# Altium project Isengard.PrjPcb
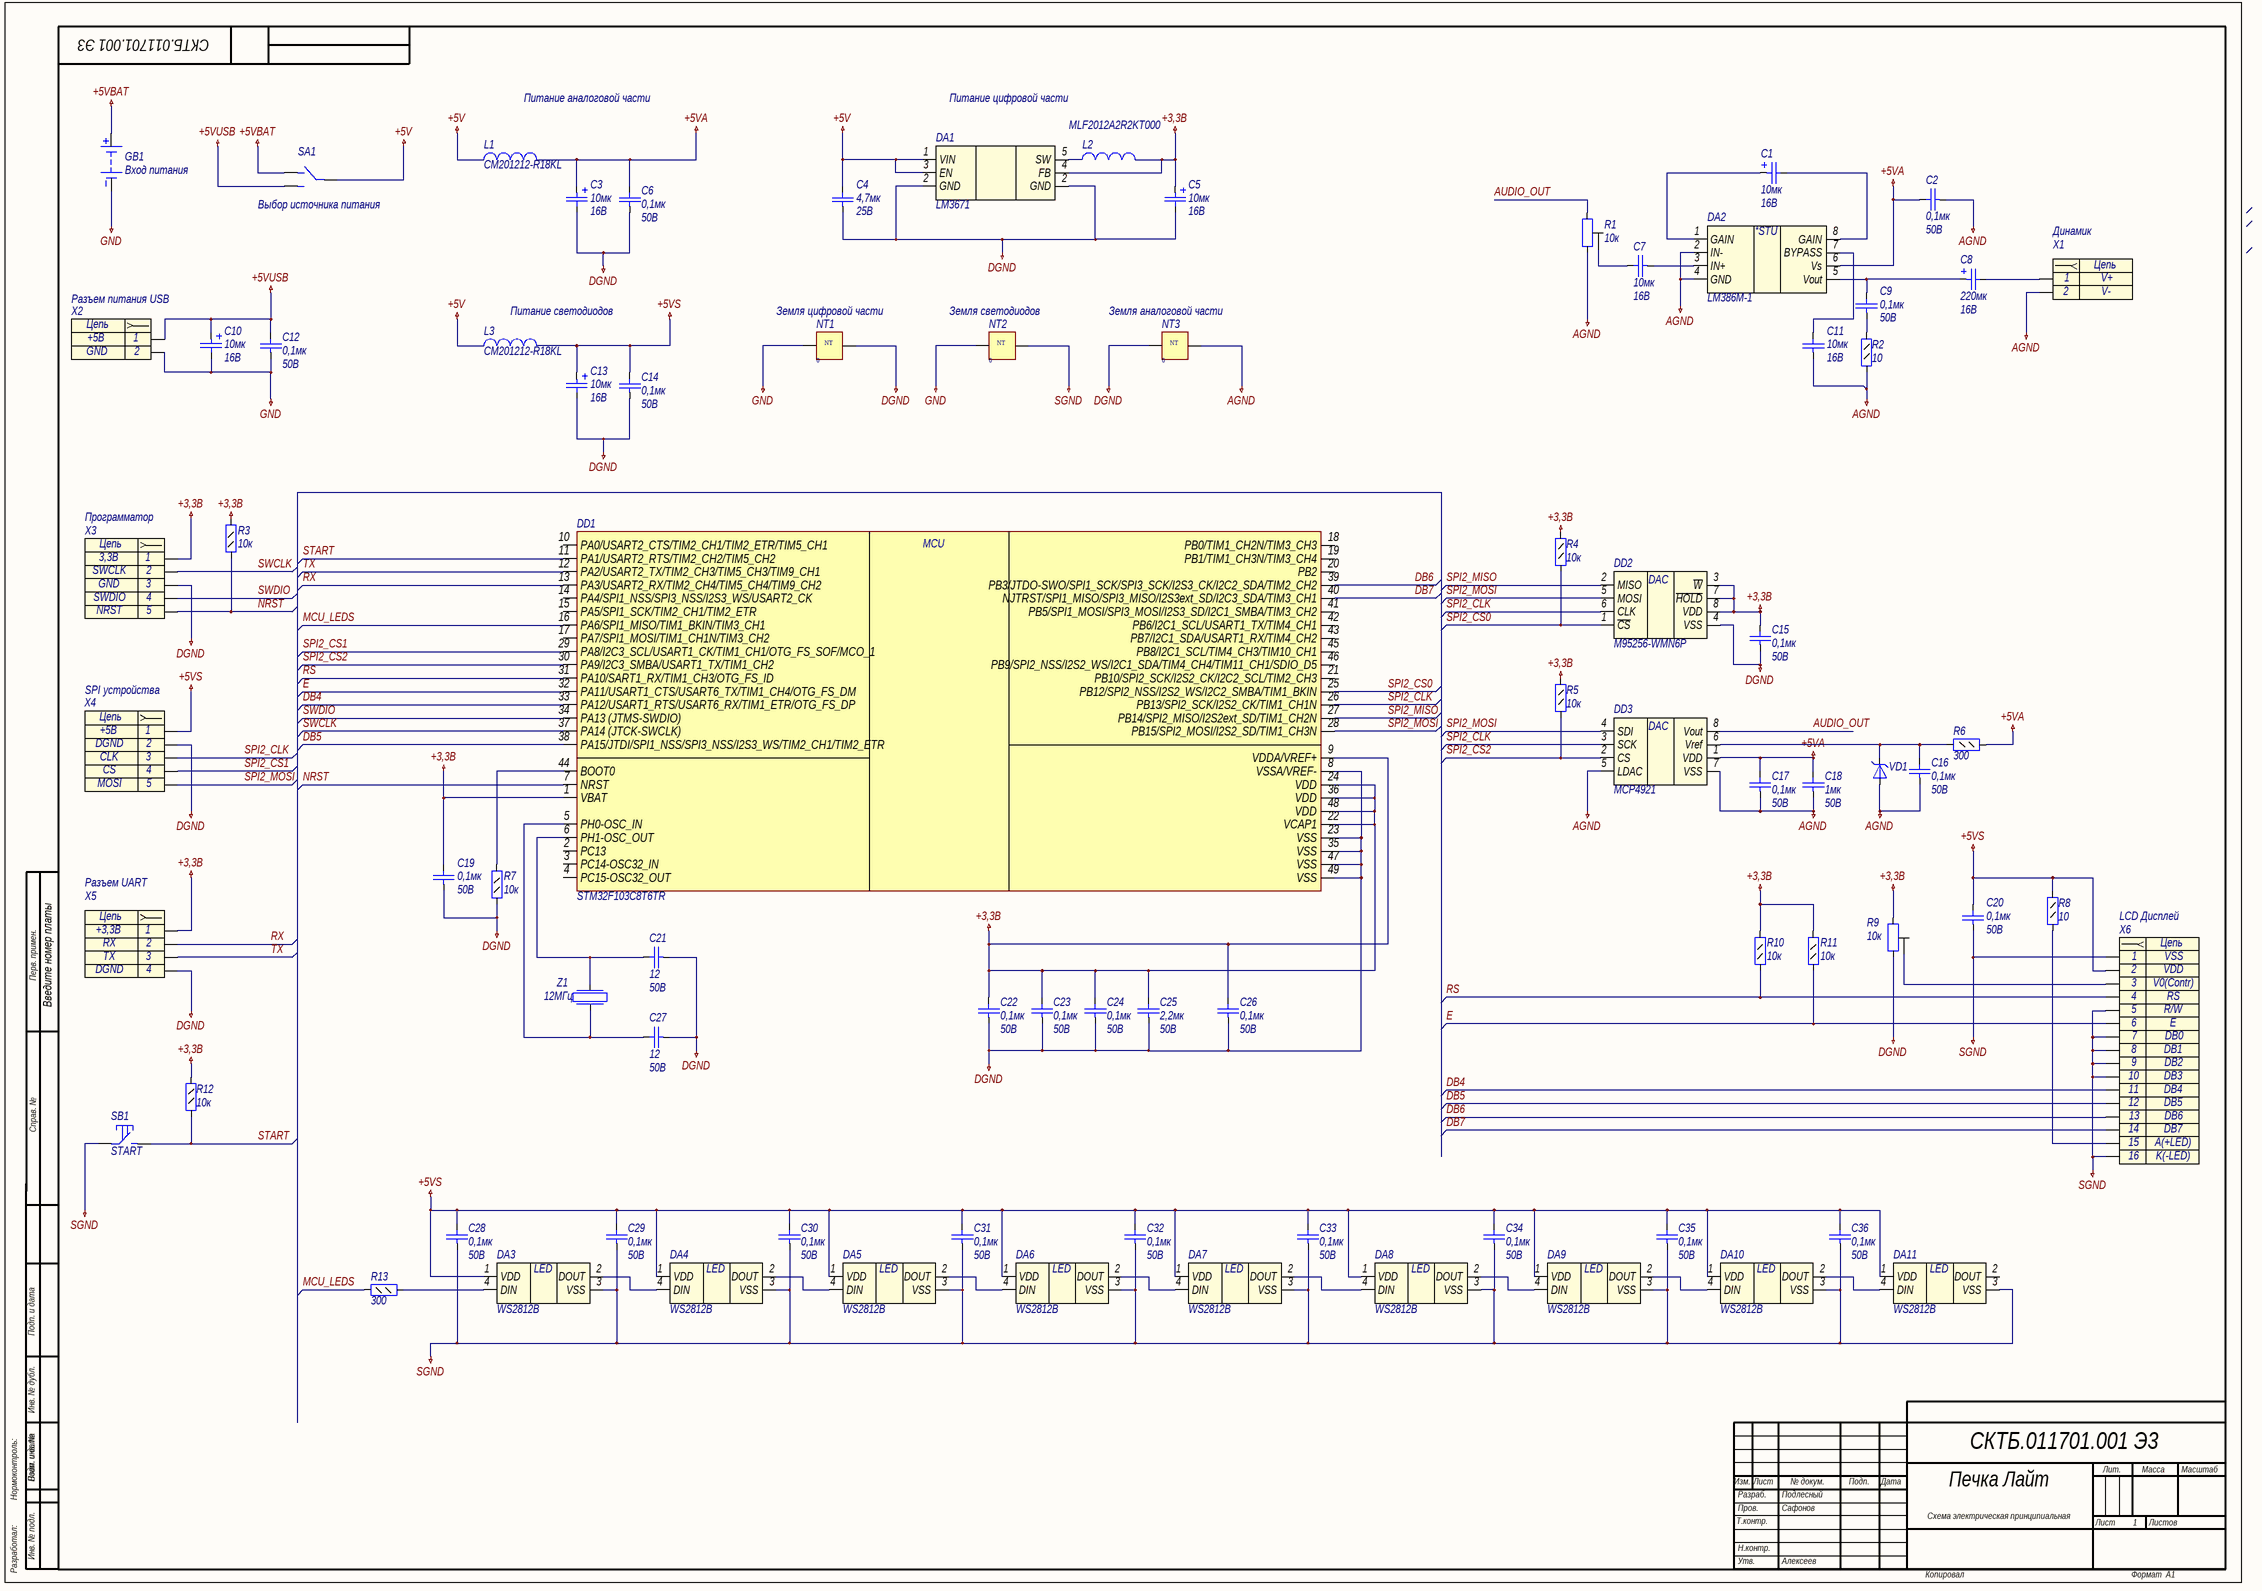
[diagram p0: Isengard.SchDoc]
1 sheet, 80 parts. Net scope: global (net labels, ports and power ports of the same name join across sheets).
Board file: Isengard.PcbDoc

## Sheet Isengard.SchDoc: Печка Лайт
size 840 x 594 mm; ApprovedBy: Алексеев; CheckedBy: Сафонов; Author: Подлесный; CompanyName: ЦНИИ РТК; DrawnBy: Подлесный; Engineer: Подлесный; Organization: ЦНИИ РТК; DocumentNumber: СКТБ.011701.001 Э3; Revision: Королев; SheetTotal: 1; DocumentType: Схема электрическая принципиальная; Format: A1; PageSetup: Record=PageOptions|CenterHorizontal=True|CenterVertical=True|PrintScale=0.35|XCorrection=1.00|YCorrection=1.00|PrintKind=1|BorderSize=5000000|LeftOffset=0|BottomOffset=0|Orientation=2|PaperLength=2970|PaperWidth=2100|Scale=100|PaperSource=7|PrintQuality=600|MediaType=1|DitherType=10|PrintScaleMode=1|PaperKind=A4|PaperIndex=9; DocumentName: Подарочный Кубок; ImagePath: Введите номер платы

### Parts
C1  Voltage: 16В  [TANTAL CASE B]  (hidden comment: 10мк)
C2  Voltage: 50В  [C0805]  (hidden comment: 0,1мк)
C3  Voltage: 16В  [TANTAL CASE B]  (hidden comment: 10мк)
C4  Voltage: 25В  [C0805]  (hidden comment: 4,7мк)
C5  Voltage: 16В  [TANTAL CASE B]  (hidden comment: 10мк)
C6  Voltage: 50В  [C0805]  (hidden comment: 0,1мк)
C7  Voltage: 16В  [C0805]  (hidden comment: 10мк)
C8  Voltage: 16В  [TANTAL CASE D]  (hidden comment: 220мк)
C9  Voltage: 50В  [C0805]  (hidden comment: 0,1мк)
C10  Voltage: 16В  [TANTAL CASE B]  (hidden comment: 10мк)
C11  Voltage: 16В  [C0805]  (hidden comment: 10мк)
C12  Voltage: 50В  [C0805]  (hidden comment: 0,1мк)
C13  Voltage: 16В  [TANTAL CASE B]  (hidden comment: 10мк)
C14  Voltage: 50В  [C0805]  (hidden comment: 0,1мк)
C15  Voltage: 50В  [C0805]  (hidden comment: 0,1мк)
C16  Voltage: 50В  [C0805]  (hidden comment: 0,1мк)
C17  Voltage: 50В  [C0805]  (hidden comment: 0,1мк)
C18  Voltage: 50В  [C0805]  (hidden comment: 1мк)
C19  Voltage: 50В  [C0805]  (hidden comment: 0,1мк)
C20  Voltage: 50В  [C0805]  (hidden comment: 0,1мк)
C21  Voltage: 50В  [C0805]  (hidden comment: 12)
C22  Voltage: 50В  [C0805]  (hidden comment: 0,1мк)
C23  Voltage: 50В  [C0805]  (hidden comment: 0,1мк)
C24  Voltage: 50В  [C0805]  (hidden comment: 0,1мк)
C25  Voltage: 50В  [C0805]  (hidden comment: 2,2мк)
C26  Voltage: 50В  [C0805]  (hidden comment: 0,1мк)
C27  Voltage: 50В  [C0805]  (hidden comment: 12)
C28  Voltage: 50В  [C0805]  (hidden comment: 0,1мк)
C29  Voltage: 50В  [C0805]  (hidden comment: 0,1мк)
C30  Voltage: 50В  [C0805]  (hidden comment: 0,1мк)
C31  Voltage: 50В  [C0805]  (hidden comment: 0,1мк)
C32  Voltage: 50В  [C0805]  (hidden comment: 0,1мк)
C33  Voltage: 50В  [C0805]  (hidden comment: 0,1мк)
C34  Voltage: 50В  [C0805]  (hidden comment: 0,1мк)
C35  Voltage: 50В  [C0805]  (hidden comment: 0,1мк)
C36  Voltage: 50В  [C0805]  (hidden comment: 0,1мк)
DA1  LM3671  [SOT23-5]
DA2  LM386M-1  [SO8]
DA3  WS2812B  [WS2812B]
DA4  WS2812B  [WS2812B]
DA5  WS2812B  [WS2812B]
DA6  WS2812B  [WS2812B]
DA7  WS2812B  [WS2812B]
DA8  WS2812B  [WS2812B]
DA9  WS2812B  [WS2812B]
DA10  WS2812B  [WS2812B]
DA11  WS2812B  [WS2812B]
DD1  STM32F103C8T6TR  [LQFP48]
DD2  M95256-WMN6P  [SO8]
DD3  MCP4921  [SO8]
GB1  Вход питания  [KLS5-818-С]
L1  CM201212-R18KL  [L0805]
L2  MLF2012A2R2KT000  [L0805]
L3  CM201212-R18KL  [L0805]
NT1  value 0  [Pofigistor0603]  (hidden comment: Pofigistor)  (net tie, no BOM)
NT2  value 0  [Pofigistor0603]  (hidden comment: Pofigistor)  (net tie, no BOM)
NT3  value 0  [Pofigistor0603]  (hidden comment: Pofigistor)  (net tie, no BOM)
R1  10к  [Potentiometer]
R2  10  [R0805]
R3  10к  [R0805]
R4  10к  [R0805]
R5  10к  [R0805]
R6  300  [R0805]
R7  10к  [R0805]
R8  10  [R0805]
R9  10к  [Potentiometer]
R10  10к  [R0805]
R11  10к  [R0805]
R12  10к  [R0805]
R13  300  [R0805]
SA1  Выбор источника питания  [KLS7-SS03]
SB1  START  [Button_SMD_12х12]
VD1  LM4040BIM3-2.5/NOPB  [SOT23-3]  (value not drawn)
X1  Динамик  [DYNAMIC]
X2  Разъем питания USB  [USB-B Micro 2pin]
X3  Программатор  [PLS-5]
X4  SPI устройства  [5HOLE_WIRE]
X5  Разъем UART  [PLS-4]
X6  LCD Дисплей  [PLS-16R]
Z1  12МГц  [HC-49SM]

### Nets
+3,3В: C5.1 C15.2 C19.2 C22.2 C23.2 C24.2 C25.2 C26.2 DA1.4(FB) DD1.1(VBAT) DD1.9(VDDA/VREF+) DD1.22(VCAP1) DD1.24(VDD) DD1.36(VDD) DD1.48(VDD) DD2.3(~{W}) DD2.7(~{HOLD}) DD2.8(VDD) L2.2 R3.2 R4.1 R5.1 R9.1 R10.2 R11.2 R12.1 X3.1 X5.1
+5V: C4.2 DA1.1(VIN) DA1.3(EN) L1.1 L3.1 SA1.2
+5VA: C2.2 C3.1 C6.2 C17.2 C18.2 DA2.6(Vs) DD3.1(VDD) L1.2 R6.1
+5VBAT: GB1.1 SA1.1
+5VS: C13.1 C14.2 C20.2 C28.2 C29.2 C30.2 C31.2 C32.2 C33.2 C34.2 C35.2 C36.2 DA3.1(VDD) DA4.1(VDD) DA5.1(VDD) DA6.1(VDD) DA7.1(VDD) DA8.1(VDD) DA9.1(VDD) DA10.1(VDD) DA11.1(VDD) L3.2 R8.1 X4.1 X6.2
+5VUSB: C10.1 C12.2 SA1.3 X2.1
AGND: C2.1 C11.1 C16.1 C17.1 C18.1 DA2.2(IN-) DA2.4(GND) DD3.5(LDAC) DD3.7(VSS) NT3.2 R1.3 R2.2 VD1.2(A) X1.2
DGND: C3.2 C4.1 C5.2 C6.1 C13.2 C14.1 C15.1 C19.1 C21.1 C22.1 C23.1 C24.1 C25.1 C26.1 C27.1 DA1.2(GND) DD1.8(VSSA/VREF-) DD1.23(VSS) DD1.35(VSS) DD1.47(VSS) DD1.49(VSS) DD2.4(VSS) NT1.2 NT3.1 R7.1 R9.3 X3.3 X4.2 X5.4
GND: C10.2 C12.1 GB1.2 NT1.1 NT2.1 X2.2
SGND: C20.1 C28.1 C29.1 C30.1 C31.1 C32.1 C33.1 C34.1 C35.1 C36.1 DA3.3(VSS) DA4.3(VSS) DA5.3(VSS) DA6.3(VSS) DA7.3(VSS) DA8.3(VSS) DA9.3(VSS) DA10.3(VSS) DA11.3(VSS) NT2.2 SB1.1 X6.1 X6.5 X6.7 X6.8 X6.9 X6.10 X6.16
AUDIO_OUT: DD3.8(Vout) R1.1
DB4: DD1.33(PA12/USART1_RTS/USART6_RX/TIM1_ETR/OTG_FS_DP) X6.11
DB5: DD1.38(PA15/JTDI/SPI1_NSS/SPI3_NSS/I2S3_WS/TIM2_CH1/TIM2_ETR) X6.12
DB6: DD1.39(PB3/JTDO-SWO/SPI1_SCK/SPI3_SCK/I2S3_CK/I2C2_SDA/TIM2_CH2) X6.13
DB7: DD1.40(NJTRST/SPI1_MISO/SPI3_MISO/I2S3ext_SD/I2C3_SDA/TIM3_CH1) X6.14
E: DD1.32(PA11/USART1_CTS/USART6_TX/TIM1_CH4/OTG_FS_DM) R11.1 X6.6
MCU_LEDS: DD1.16(PA6/SPI1_MISO/TIM1_BKIN/TIM3_CH1) R13.1
NRST: DD1.7(NRST) R3.1 X3.5
RS: DD1.31(PA10/SART1_RX/TIM1_CH3/OTG_FS_ID) R10.1 X6.4
RX: DD1.13(PA3/USART2_RX/TIM2_CH4/TIM5_CH4/TIM9_CH2) X5.2
SPI2_CLK: DD1.26(PB13/SPI2_SCK/I2S2_CK/TIM1_CH1N) DD2.6(CLK) DD3.3(SCK) X4.3
SPI2_CS0: DD1.25(PB12/SPI2_NSS/I2S2_WS/I2C2_SMBA/TIM1_BKIN) DD2.1(~{CS}) R4.2
SPI2_CS1: DD1.29(PA8/I2C3_SCL/USART1_CK/TIM1_CH1/OTG_FS_SOF/MCO_1) X4.4
SPI2_CS2: DD1.30(PA9/I2C3_SMBA/USART1_TX/TIM1_CH2) DD3.2(CS) R5.2
SPI2_MISO: DD1.27(PB14/SPI2_MISO/I2S2ext_SD/TIM1_CH2N) DD2.2(MISO)
SPI2_MOSI: DD1.28(PB15/SPI2_MOSI/I2S2_SD/TIM1_CH3N) DD2.5(MOSI) DD3.4(SDI) X4.5
START: DD1.11(PA1/USART2_RTS/TIM2_CH2/TIM5_CH2) R12.2 SB1.4
SWCLK: DD1.37(PA14_(JTCK-SWCLK)) X3.2
SWDIO: DD1.34(PA13_(JTMS-SWDIO)) X3.4
TX: DD1.12(PA2/USART2_TX/TIM2_CH3/TIM5_CH3/TIM9_CH1) X5.3
NetC1_1: C1.1 DA2.1(GAIN)
NetC1_2: C1.2 DA2.8(GAIN)
NetC7_1: C7.1 DA2.3(IN+)
NetC7_2: C7.2 R1.2
NetC8_1: C8.1 C9.2 DA2.5(Vout)
NetC8_2: C8.2 X1.1
NetC9_1: C9.1 R2.1
NetC11_2: C11.2 DA2.7(BYPASS)
NetC16_2: C16.2 DD3.6(Vref) R6.2 VD1.1(K)
NetC21_2: C21.2 DD1.6(PH1-OSC_OUT) Z1.2
NetC27_2: C27.2 DD1.5(PH0-OSC_IN) Z1.1
NetDA1_5: DA1.5(SW) L2.1
NetDA3_2: DA3.2(DOUT) DA4.4(DIN)
NetDA3_4: DA3.4(DIN) R13.2
NetDA4_2: DA4.2(DOUT) DA5.4(DIN)
NetDA5_2: DA5.2(DOUT) DA6.4(DIN)
NetDA6_2: DA6.2(DOUT) DA7.4(DIN)
NetDA7_2: DA7.2(DOUT) DA8.4(DIN)
NetDA8_2: DA8.2(DOUT) DA9.4(DIN)
NetDA9_2: DA9.2(DOUT) DA10.4(DIN)
NetDA10_2: DA10.2(DOUT) DA11.4(DIN)
NetDD1_44: DD1.44(BOOT0) R7.2
NetR8_2: R8.2 X6.15
NetR9_2: R9.2 X6.3

Not connected (* = marked no-connect by the designer): DA11 2(DOUT); DD1 2(PC13) 3(PC14-OSC32_IN) 4(PC15-OSC32_OUT) 10(PA0/USART2_CTS/TIM2_CH1/TIM2_ETR/TIM5_CH1) 14(PA4/SPI1_NSS/SPI3_NSS/I2S3_WS/USART2_CK) 15(PA5/SPI1_SCK/TIM2_CH1/TIM2_ETR) 17(PA7/SPI1_MOSI/TIM1_CH1N/TIM3_CH2) 18(PB0/TIM1_CH2N/TIM3_CH3) 19(PB1/TIM1_CH3N/TIM3_CH4) 20(PB2) 21(PB10/SPI2_SCK/I2S2_CK/I2C2_SCL/TIM2_CH3) 41(PB5/SPI1_MOSI/SPI3_MOSI/I2S3_SD/I2C1_SMBA/TIM3_CH2) 42(PB6/I2C1_SCL/USART1_TX/TIM4_CH1) 43(PB7/I2C1_SDA/USART1_RX/TIM4_CH2) 45(PB8/I2C1_SCL/TIM4_CH3/TIM10_CH1) 46(PB9/SPI2_NSS/I2S2_WS/I2C1_SDA/TIM4_CH4/TIM11_CH1/SDIO_D5)

### Notes on the sheet
- Питание аналоговой части
- Питание цифровой части
- (near L3) Питание светодиодов
- (near NT1) Земля цифровой части
- (near NT2) Земля светодиодов
- (near NT3) Земля аналоговой части
- Перв. примен.
- Справ. №
- Подп. и дата
- Инв. № дубл.
- Взам. инв. №
- Нормоконтроль:
- Изм.
- Лист
- № докум.
- Подп.
- Дата
- Лит.
- Масса
- Масштаб
- Т.контр.
- Пров.
- Разраб.
- Листов
- Разработал:
- Инв. № подл.
- Н.контр.
- Утв.
- Копировал
- Формат
- (in symbol Header_2_sct) Цепь
- (in symbol Header_4_sct) Цепь
- (in symbol Header_5_sct) Цепь
- (in symbol Header_16_sct) Цепь
- (in symbol LM386M-1) *STU
- (in symbol M95256) DAC
- (in symbol MCP4921) DAC
- (in symbol res1932) NT
- (in symbol STM32F103C8T6TR) MСU
- (in symbol WS2812B) LED

### Library data of the parts
C1 C3 C5 C8 C10 C13 = Capacitor_pol: Конденсатор полярный
  C1 C3 C5 C10 C13: Value: 10мк
  C8: Value: 220мк
C2 C4 C6 C7 C9 C11 C12 C14-C36 = Capacitor: Конденсатор
  C2 C6 C9 C12 C14-C17 C19 C20 C22-C24 C26 C28-C36: Value: 0,1мк
  C4: Value: 4,7мк
  C7 C11: Value: 10мк
  C18: Value: 1мк
  C21 C27: Value: 12
  C25: Value: 2,2мк
DA1 = LM3671: 600-mA Step-Down DC-DC Converter
DA2 = LM386M-1: Low Voltage Audio Power Amplifier
DA3-DA11 = WS2812B: Светодиод SMD RGB с пиксельной адресацией; Name: WS2812B
DD2 = M95256: 12-Bit DAC with SPI™ Interface; Name: M95256-WMN6P
DD3 = MCP4921: 12-Bit DAC with SPI™ Interface; Name: MCP4921-E/SN
GB1 = Battery compartment: Value: Вход питания
L1-L3 = Inductor: Катушка индуктивности
  L1 L3: Value: CM201212-R18KL
  L2: Value: MLF2012A2R2KT000
NT1-NT3 = res1932: id: res1932; Part Name: Pofigistor
R1 R9 = Potentiometer: Value: 10к
R2-R8 R10-R13 = Resistor_0,125Вт: Резистор
  R2 R8: Value: 10
  R3-R5 R7 R10-R12: Value: 10к
  R6 R13: Value: 300
SA1 = Toggle switch: переключатель однопозиционный; Name: Выбор источника питания
SB1 = Button_SMD: Кнопка; Name: START
VD1 = LM4040BIM3-2.5/NOPB: Прецезионный источник опорного напряжения; Part Name: Precision Micropower Shunt Voltage Reference; Voltage min stabilize: 2,5B; Accuracy: 0,002; Output current: 15mA; Part Number: LM4040BIM3-2.5/NOPB; Footprint: sot23-3
X1 = Header_2_sct: Разъем - 2 конт. розетка; Contact_1: V+; Contact_2: V-; Name: Динамик
X2 = Header_2_sct: Разъем - 2 конт. розетка; Contact_1: +5B; Contact_2: GND; Name: Разъем питания USB
X3 = Header_5_sct: Разъем - 4 конт. розетка; Contact_1: 3,3B; Contact_2: SWCLK; Contact_3: GND; Contact_4: SWDIO; Contact_5: NRST; Name: Программатор
X4 = Header_5_sct: Разъем - 4 конт. розетка; Contact_1: +5B; Contact_2: DGND; Contact_3: CLK; Contact_4: CS; Contact_5: MOSI; Name: SPI устройства
X5 = Header_4_sct: Разъем - 4 конт. розетка; Contact_1: +3,3B; Contact_2: RX; Contact_3: TX; Contact_4: DGND; Name: Разъем UART
X6 = Header_16_sct: Разъем - 16 конт. розетка; Contact_1: VSS; Contact_2: VDD; Contact_3: V0(Contr); Contact_4: RS; Contact_5: R/W; Contact_6: E; Contact_7: DB0; Contact_8: DB1; Contact_9: DB2; Contact_10: DB3; Contact_11: DB4; Contact_12: DB5; Contact_13: DB6; Contact_14: DB7; Contact_16: K(-LED); Contact_15: A(+LED); Name: LCD Дисплей
Z1 = Crystal: Кварцевый резонатор; Value: 12МГц
DD1 = STM32F103C8T6TR: Name: STM32F103C8T6TR